# EasyEDA schematic mediacontroller_sender.json
TITLE: sender; REV: 1.0; Date: 2019-05-26; Sheet: 1/1; Drawn By: asderv22
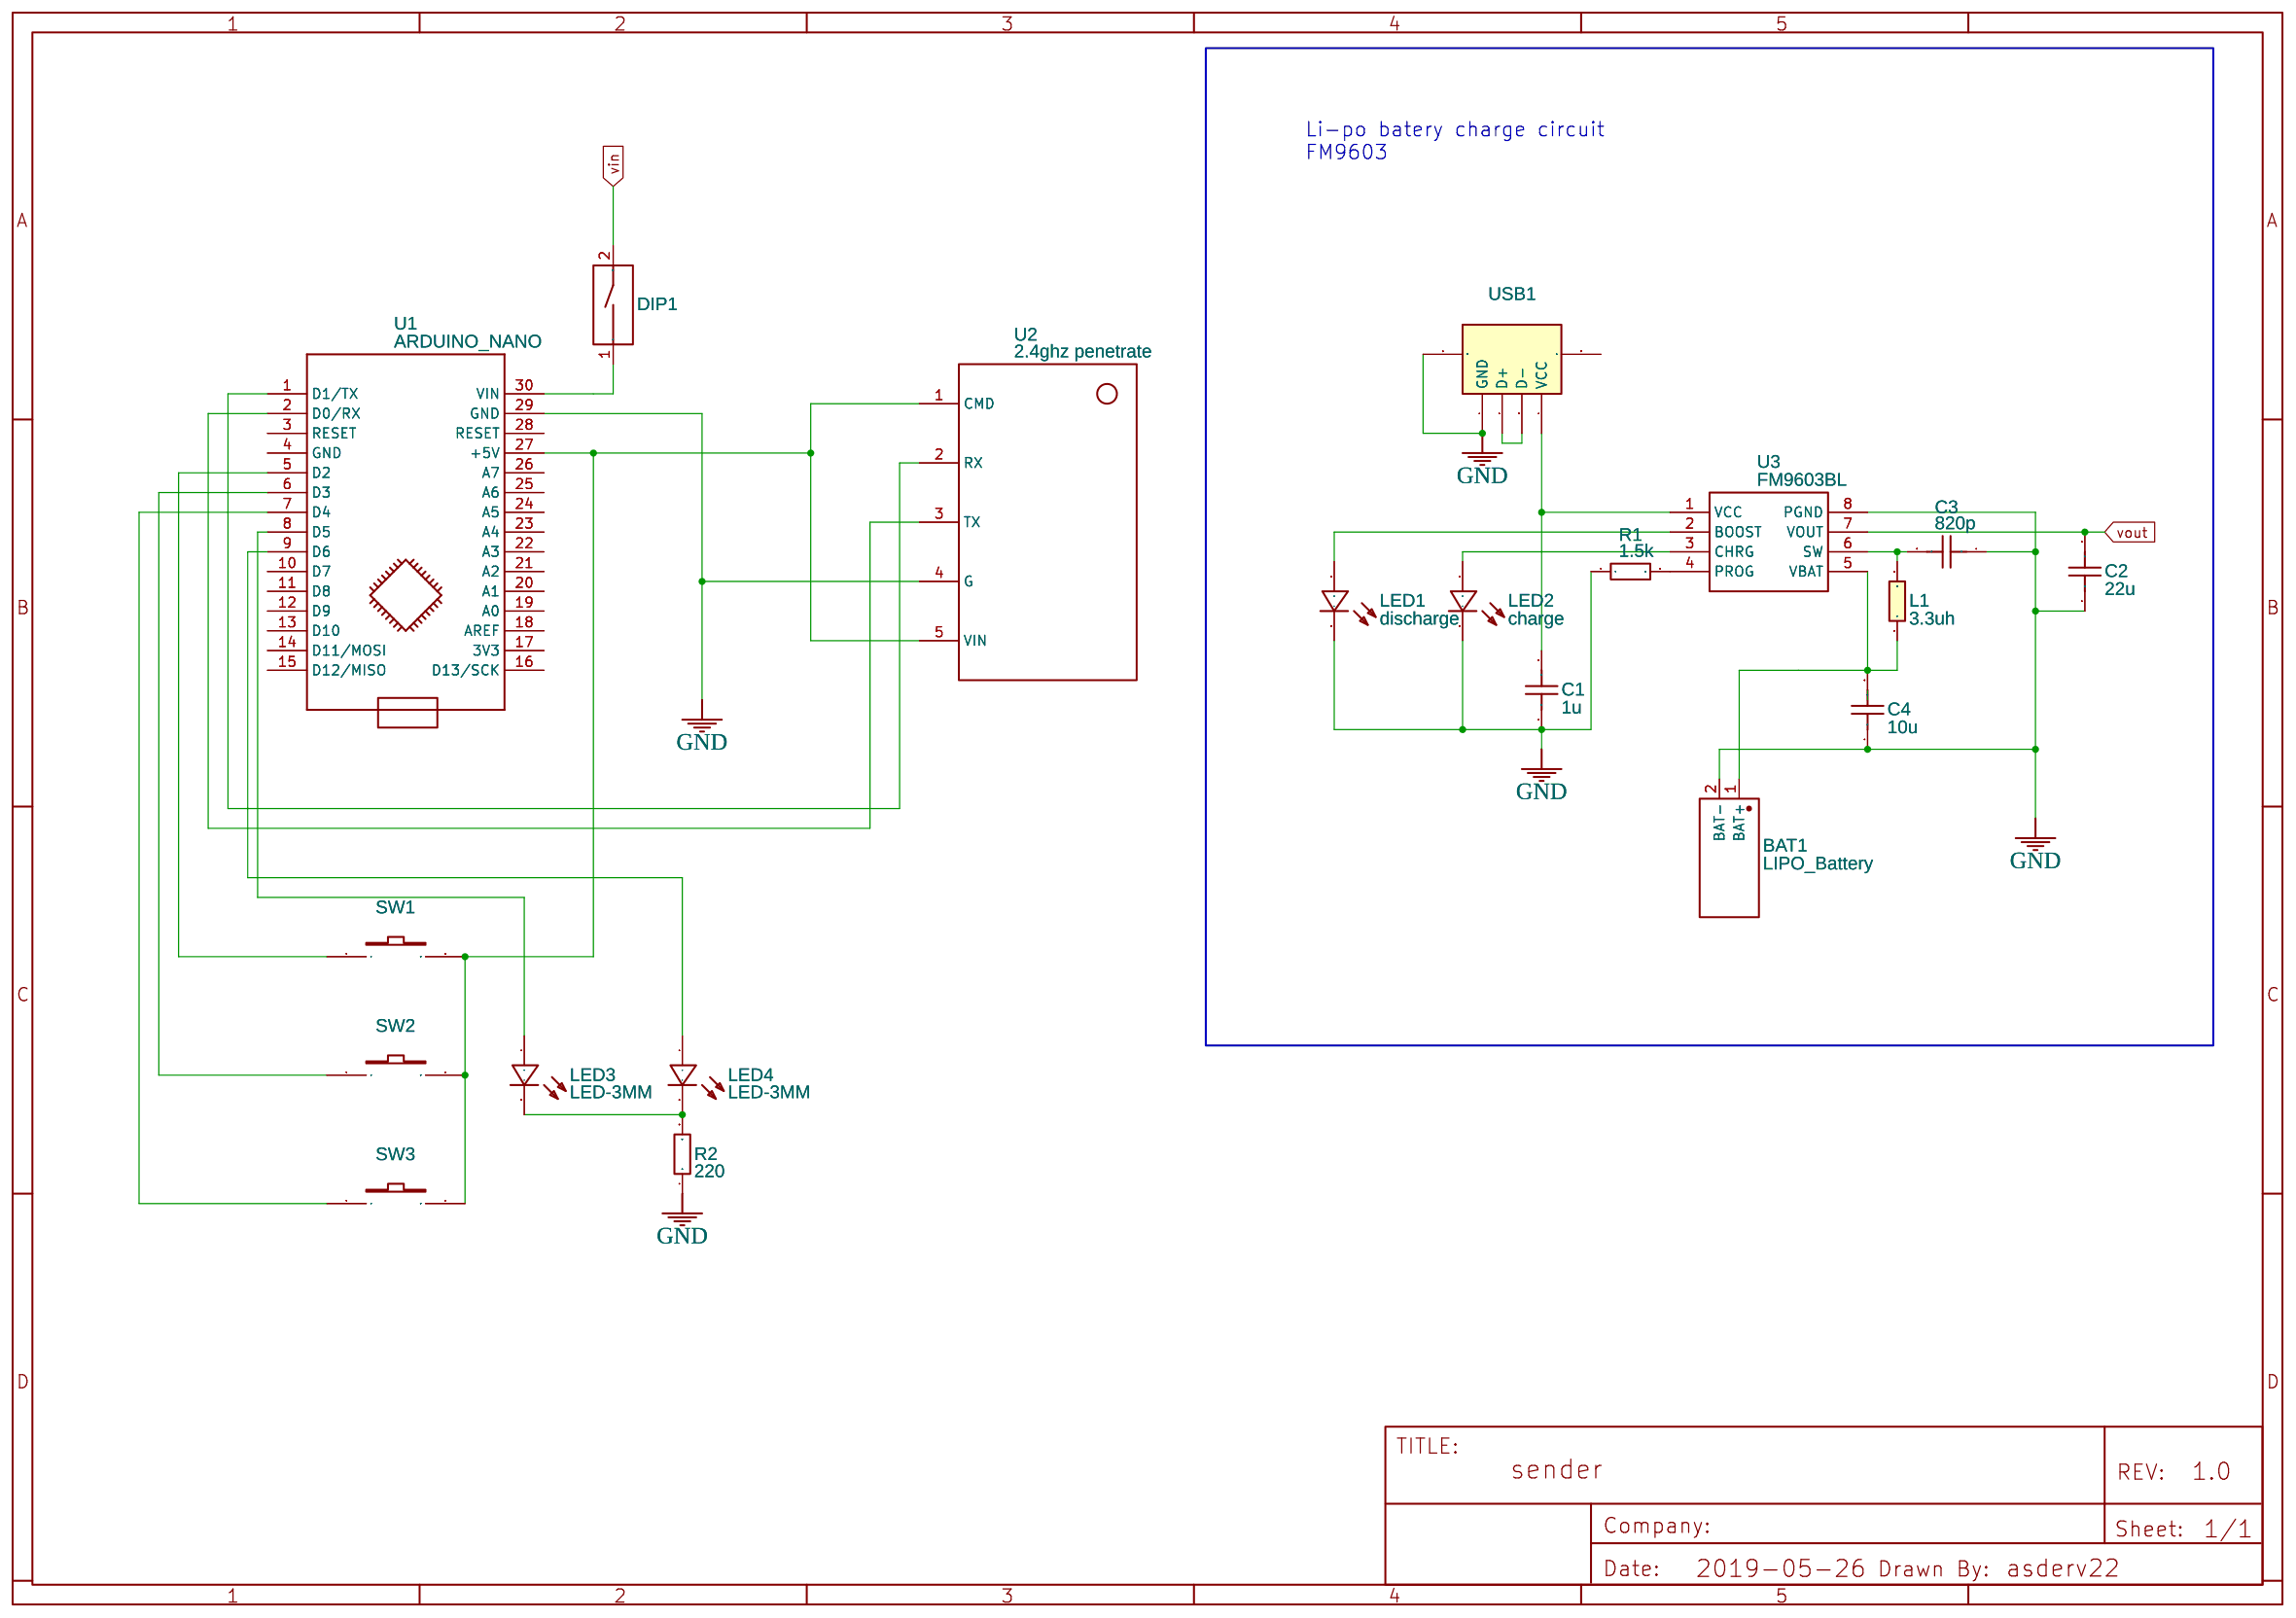
[diagram p0: schematic sheet]

## Parts
BAT1  LIPO_Battery
C1  1u  [RAD-0.1]
C2  22u  [RAD-0.1]
C3  820p  [RAD-0.1]
C4  10u  [RAD-0.1]
DIP1  VDG/S-01L blue  [VDG/S-01L]
L1  3.3uh  [AXIAL-0.4]
LED1  discharge  [LED-3MM/2.54]
LED2  charge  [LED-3MM/2.54]
LED3  LED-3MM  [LED-3MM/2.54]
LED4  LED-3MM  [LED-3MM/2.54]
R1  1.5k  [AXIAL-0.3]
R2  220  [AXIAL-0.3]
SW1  EVQ22705R  [KEY-6.0*6.0-4]
SW2  EVQ22705R  [KEY-6.0*6.0-4]
SW3  EVQ22705R  [KEY-6.0*6.0-4]
U1  ARDUINO_NANO  [ARDUINO_NANO]
U2  2.4ghz penetrate
U3  FM9603BL  [ESOP-8]
USB1  USBConnector AF180degree13.1Straight iron Vinyl  [USB-M-22]

## Library data of the parts
BAT1 = -: Contributor: KanameAimu
C1-C4 = Cap_RAD-0.1_US: Manufacturer Part: ?
DIP1 = -: Supplier: LCSC; Manufacturer: ReliaPro; image: //image.lceda.cn/szlcsc/C47086.jpg; Supplier Part: C47086
L1 = Inductor_AXIAL-0.4_EU: Contributor: EasyEDA; Manufacturer Part: ?
LED1-LED4 = -: Supplier: LCSC; Manufacturer: EVERLIGHT; Manufacturer Part: 204-10SURD/S530-A3; Supplier Part: C99772
R1 R2 = Res_AXIAL-0.3(1/8W)_EU: Manufacturer Part: ?
SW1-SW3 = -: Supplier: LCSC; Manufacturer: PANASONIC; Contributor: LCSC; Supplier Part: C79156
U1 = -: sourceId: KGSeAWhDB; Manufacturer Part: ?
U2 = -: Manufacturer Part: ?; Contributor: asderv22
U3 = -: Supplier Part: undefined; Supplier: LCSC; Manufacturer: FM
USB1 = -: Supplier: LCSC; Manufacturer: ValuePro; image: //image.lceda.cn/szlcsc/C65604.jpg; Supplier Part: C65604

## Nets
GND: BAT1.2(BAT-) C1.1 C2.1 C3.1 C4.1 LED1.2(-) LED2.2(-) R1.1 R2.1 U1.29(GND) U2.4(G) U3.8(PGND) USB1.0 USB1.4(GND)
vin: DIP1.2
vout: C2.2 U3.7(VOUT)
Net-(BAT1-1): BAT1.1(BAT+) C4.2 L1.1 U3.5(VBAT)
Net-(C1-2): C1.2 U3.1(VCC) USB1.1(VCC)
Net-(C3-2): C3.2 L1.2 U3.6(SW)
Net-(DIP1-1): DIP1.1 U1.30(VIN)
Net-(LED1-1): LED1.1(+) U3.2(BOOST)
Net-(LED2-1): LED2.1(+) U3.3(CHRG)
Net-(LED3-1): LED3.1(+) U1.8(D5)
Net-(LED3-2): LED3.2(-) LED4.2(-) R2.2
Net-(LED4-1): LED4.1(+) U1.9(D6)
Net-(R1-2): R1.2 U3.4(PROG)
Net-(SW1-1): SW1.1 U1.5(D2)
Net-(SW1-2): SW1.2 SW2.2 SW3.2 U1.27(+5V) U2.1(CMD) U2.5(VIN)
Net-(SW2-1): SW2.1 U1.6(D3)
Net-(SW3-1): SW3.1 U1.7(D4)
Net-(U1-1): U1.1(D1/TX) U2.2(RX)
Net-(U1-2): U1.2(D0/RX) U2.3(TX)
Net-(USB1-2): USB1.2(D-) USB1.3(D+)

Not connected (* = marked no-connect by the designer): U1 3(RESET) 4(GND) 10(D7) 11(D8) 12(D9) 13(D10) 14(D11/MOSI) 15(D12/MISO) 16(D13/SCK) 17(3V3) 18(AREF) 19(A0) 20(A1) 21(A2) 22(A3) 23(A4) 24(A5) 25(A6) 26(A7) 28(RESET)

## Notes on the sheet
- Li-po batery charge circuit
  FM9603
